# EAGLE design KW_Control (EAGLE 7.7.0)
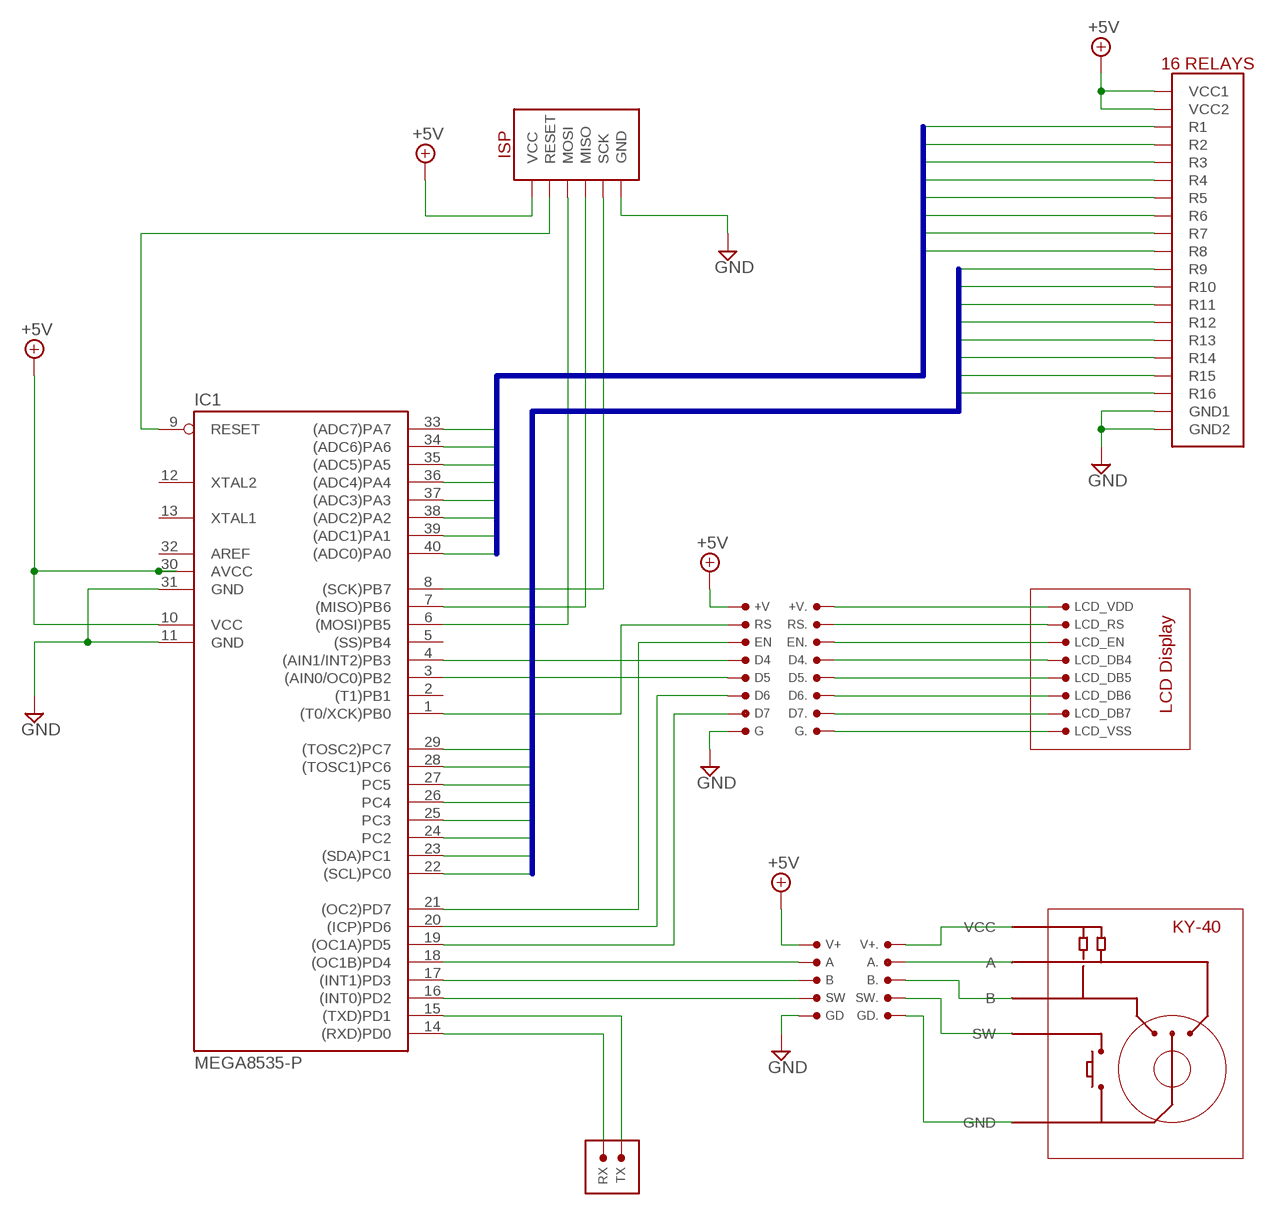
[diagram p0: schematic, sheet 1]

## Parts
+V  PIN  [PIN]
+V.  PIN  [PIN]
A  PIN  [PIN]
A.  PIN  [PIN]
B  PIN  [PIN]
B.  PIN  [PIN]
D4  PIN  [PIN]
D4.  PIN  [PIN]
D5  PIN  [PIN]
D5.  PIN  [PIN]
D6  PIN  [PIN]
D6.  PIN  [PIN]
D7  PIN  [PIN]
D7.  PIN  [PIN]
EN  PIN  [PIN]
EN.  PIN  [PIN]
G  PIN  [PIN]
G.  PIN  [PIN]
GD  PIN  [PIN]
GD.  PIN  [PIN]
IC1  MEGA8535-P  [DIL40]
IC2  KY-40  [KY-40]
LCD_DB4  PIN  [PIN]
LCD_DB5  PIN  [PIN]
LCD_DB6  PIN  [PIN]
LCD_DB7  PIN  [PIN]
LCD_EN  PIN  [PIN]
LCD_RS  PIN  [PIN]
LCD_VDD  PIN  [PIN]
LCD_VSS  PIN  [PIN]
RS  PIN  [PIN]
RS.  PIN  [PIN]
RX  PIN  [PIN]
SW  PIN  [PIN]
SW.  PIN  [PIN]
TX  PIN  [PIN]
U$1  ISP  [ISP]
U$2  RELAYS-16  [RELAYS-16]
V+  PIN  [PIN]
V+.  PIN  [PIN]

## Nets
+5V: +V.P$1(PIN1) IC1.10(VCC) IC1.30(AVCC) U$1.VCC U$2.VCC1 U$2.VCC2 V+.P$1(PIN1)
A1: IC1.40((ADC0)PA0) U$2.1(R1)
A2: IC1.39((ADC1)PA1) U$2.2(R2)
A3: IC1.38((ADC2)PA2) U$2.3(R3)
A4: IC1.37((ADC3)PA3) U$2.4(R4)
A5: IC1.36((ADC4)PA4) U$2.5(R5)
A6: IC1.35((ADC5)PA5) U$2.6(R6)
A7: IC1.34((ADC6)PA6) U$2.7(R7)
A8: IC1.33((ADC7)PA7) U$2.8(R8)
B1: IC1.22((SCL)PC0) U$2.9(R9)
B2: IC1.23((SDA)PC1) U$2.10(R10)
B3: IC1.24(PC2) U$2.11(R11)
B4: IC1.25(PC3) U$2.12(R12)
B5: IC1.26(PC4) U$2.13(R13)
B6: IC1.27(PC5) U$2.14(R14)
B7: IC1.28((TOSC1)PC6) U$2.15(R15)
B8: IC1.29((TOSC2)PC7) U$2.16(R16)
GND: G.P$1(PIN1) GD.P$1(PIN1) IC1.11(GND) IC1.31(GND) U$1.GND U$2.GND1 U$2.GND2
MISO: IC1.7((MISO)PB6) U$1.MISO
MOSI: IC1.6((MOSI)PB5) U$1.MOSI
N$1: D7.P$1(PIN1) IC1.19((OC1A)PD5)
N$2: D6.P$1(PIN1) IC1.20((ICP)PD6)
N$3: D5.P$1(PIN1) IC1.3((AIN0/OC0)PB2)
N$4: D4.P$1(PIN1) IC1.4((AIN1/INT2)PB3)
N$5: +V..P$1(PIN1) LCD_VDD.P$1(PIN1)
N$6: G..P$1(PIN1) LCD_VSS.P$1(PIN1)
N$7: D4..P$1(PIN1) LCD_DB4.P$1(PIN1)
N$8: D7..P$1(PIN1) LCD_DB7.P$1(PIN1)
N$9: A.P$1(PIN1) IC1.18((OC1B)PD4)
N$10: B.P$1(PIN1) IC1.17((INT1)PD3)
N$11: IC1.16((INT0)PD2) SW.P$1(PIN1)
N$12: A..P$1(PIN1) IC2.A
N$13: B..P$1(PIN1) IC2.B
N$14: IC2.SW SW..P$1(PIN1)
N$15: IC2.VCC V+..P$1(PIN1)
N$16: GD..P$1(PIN1) IC2.GND
N$17: D6..P$1(PIN1) LCD_DB6.P$1(PIN1)
N$18: EN..P$1(PIN1) LCD_EN.P$1(PIN1)
N$19: LCD_RS.P$1(PIN1) RS..P$1(PIN1)
N$20: D5..P$1(PIN1) LCD_DB5.P$1(PIN1)
N$21: EN.P$1(PIN1) IC1.21((OC2)PD7)
N$23: IC1.1((T0/XCK)PB0) RS.P$1(PIN1)
RESET: IC1.9(RESET) U$1.RESET
RX: IC1.14((RXD)PD0) RX.P$1(PIN1)
SCK: IC1.8((SCK)PB7) U$1.SCK
TX: IC1.15((TXD)PD1) TX.P$1(PIN1)
Unconnected: IC1.2((T1)PB1) IC1.5((SS)PB4) IC1.12(XTAL2) IC1.13(XTAL1) IC1.32(AREF)

## Buses
A[1..8]
B[1..8]

## Notes on the sheet
- LCD Display

## Library data of the parts
+V +V. A A. B B. D4 D4. D5 D5. D6 D6. D7 D7. EN EN. G G. GD GD. LCD_DB4-LCD_DB7 LCD_EN LCD_RS LCD_VDD LCD_VSS RS RS. RX SW SW. TX V+ V+. = Connectors:PIN: SINGLE PIN
IC1 = atmel:MEGA8535-P: MICROCONTROLLER 8 Kbytes FLASH 512 bytes SRAM 512 bytes EEPROM USART 8-channel 10 bit ADC Source: avr.lbr; MPN: ATMEGA8535-16PU; OC_FARNELL: 9171444; OC_NEWARK: 01M6909
IC2 = Boutons:KY-40: KY-40 ROTATRY ENCODER WITH SWITCH
U$1 = Connectors:ISP: ISP AVR ISP 6 pins Connector
U$2 = Connectors:RELAYS-16: ISP AVR ISP 6 pins Connector

## Board
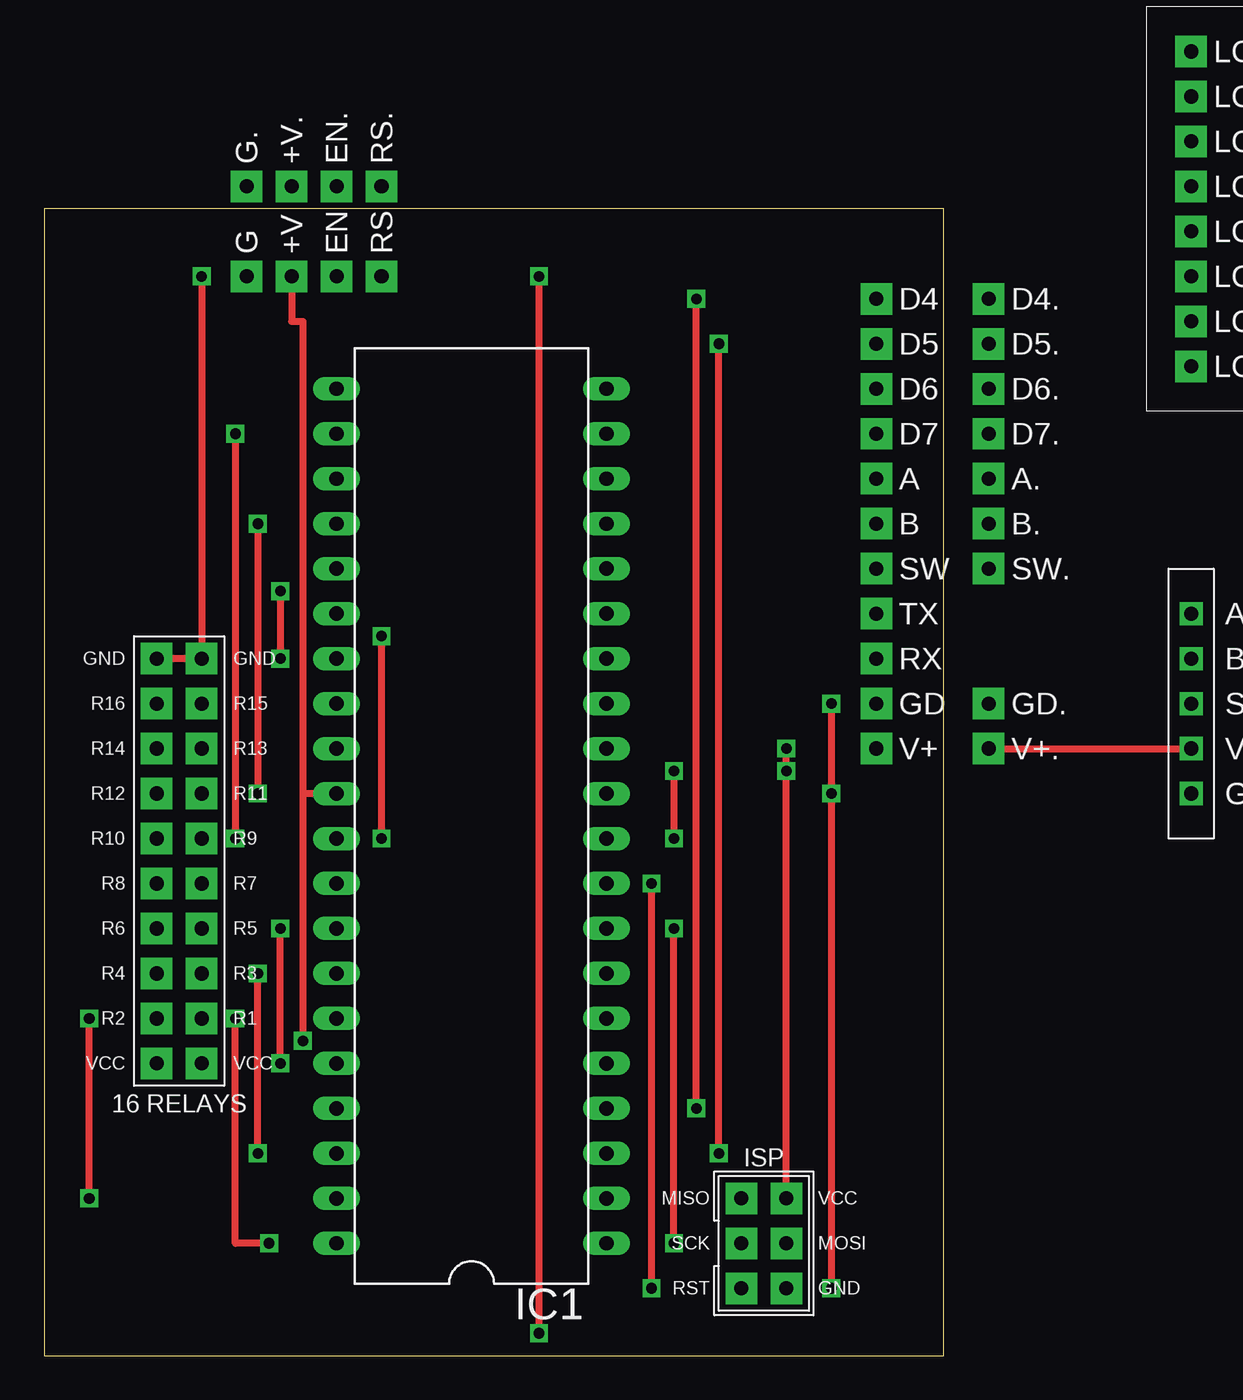
[diagram p1: board, top side]
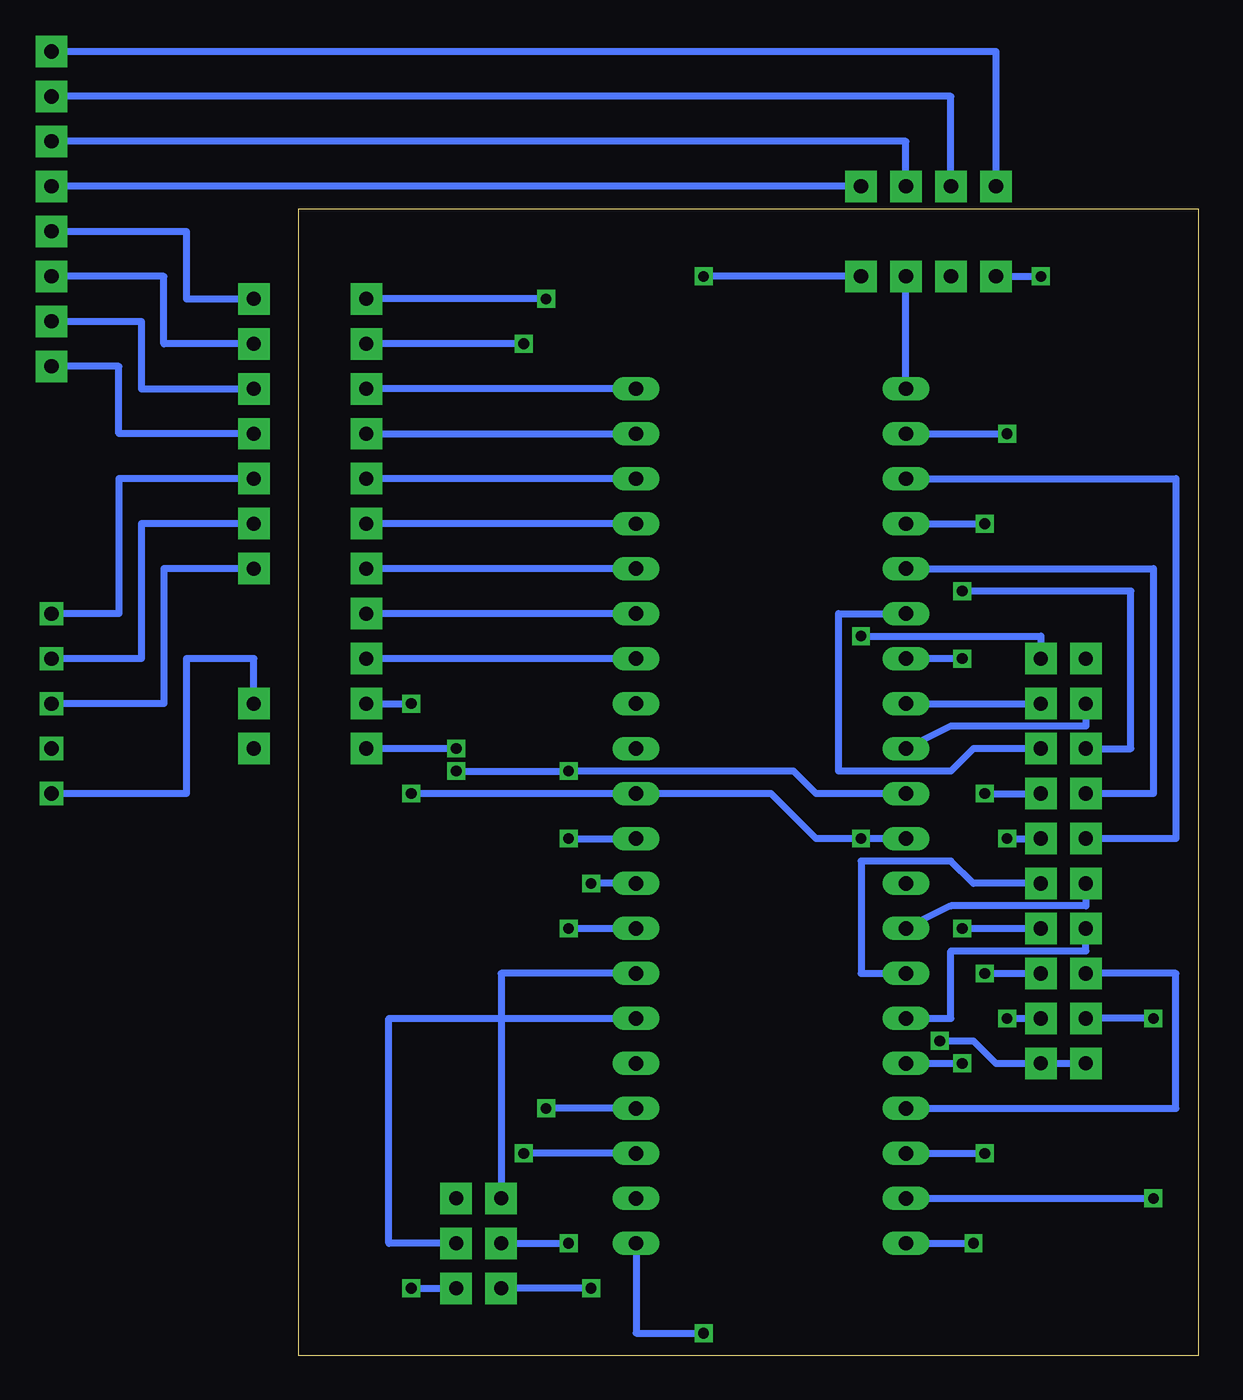
[diagram p2: board, bottom side, seen from below]

Size 50.8 x 64.77 mm. Coordinates in mm from the lower left corner, seen from the top.
Outline: 50.8,64.77 0,64.77 0,0 50.8,0 50.8,64.77
Copper layers (1*16): Top 0.035mm / dielectric 1.5mm / Bottom 0.035mm
Design rules "default": minimum track width 10mil, minimum drill 24mil, track to track 8mil, track to pad 8mil, pad to pad 8mil, via to via 8mil, smd to smd 8mil, copper to edge 40mil, drill to drill 8mil, minimum pad ring 10mil, minimum via ring 8mil, stop-mask expansion 4mil, vias tented up to drill 0mil, thermal gap 10mil

### Footprints (pad centres in the part's own frame; a part is rotated, then mirrored left to right if it is on the bottom)
PIN = drill 0.8 pad 1.778 square: P$1 0,0
DIL40 = drill 0.813 long: 1 -24.13,-7.62; 2 -21.59,-7.62; 3 -19.05,-7.62; 4 -16.51,-7.62; 5 -13.97,-7.62; 6 -11.43,-7.62; 7 -8.89,-7.62; 8 -6.35,-7.62; 9 -3.81,-7.62; 10 -1.27,-7.62; 11 1.27,-7.62; 12 3.81,-7.62; 13 6.35,-7.62; 14 8.89,-7.62; 15 11.43,-7.62; 16 13.97,-7.62; 17 16.51,-7.62; 18 19.05,-7.62; 19 21.59,-7.62; 20 24.13,-7.62; 21 24.13,7.62; 22 21.59,7.62; 23 19.05,7.62; 24 16.51,7.62; 25 13.97,7.62; 26 11.43,7.62; 27 8.89,7.62; 28 6.35,7.62; 29 3.81,7.62; 30 1.27,7.62; 31 -1.27,7.62; 32 -3.81,7.62; 33 -6.35,7.62; 34 -8.89,7.62; 35 -11.43,7.62; 36 -13.97,7.62; 37 -16.51,7.62; 38 -19.05,7.62; 39 -21.59,7.62; 40 -24.13,7.62
KY-40 = drill 0.8 square: A -5.08,0; B -2.54,0; GND 5.08,0; SW 0,0; VCC 2.54,0
ISP = drill 0.8 pad 1.778 square: GND 2.54,-5.08; MISO 0,0; MOSI 2.54,-2.54; RESET 0,-5.08; SCK 0,-2.54; VCC 2.54,0
RELAYS-16 = drill 0.8 pad 1.778 square: 1 0,-2.54; 2 2.54,-2.54; 3 0,-5.08; 4 2.54,-5.08; 5 0,-7.62; 6 2.54,-7.62; 7 0,-10.16; 8 2.54,-10.16; 9 0,-12.7; 10 2.54,-12.7; 11 0,-15.24; 12 2.54,-15.24; 13 0,-17.78; 14 2.54,-17.78; 15 0,-20.32; 16 2.54,-20.32; GND1 0,-22.86; GND2 2.54,-22.86; VCC1 0,0; VCC2 2.54,0

### Placement (x,y rotation side)
+V  13.97,60.96 90 top
+V.  13.97,66.04 90 top
A  46.99,49.53 0 top
A.  53.34,49.53 0 top
B  46.99,46.99 0 top
B.  53.34,46.99 0 top
D4  46.99,59.69 0 top
D4.  53.34,59.69 0 top
D5  46.99,57.15 0 top
D5.  53.34,57.15 0 top
D6  46.99,54.61 0 top
D6.  53.34,54.61 0 top
D7  46.99,52.07 0 top
D7.  53.34,52.07 0 top
EN  16.51,60.96 90 top
EN.  16.51,66.04 90 top
G  11.43,60.96 90 top
G.  11.43,66.04 90 top
GD  46.99,36.83 0 top
GD.  53.34,36.83 0 top
IC1  24.13,30.48 90 top
IC2  64.77,36.83 270 top  (outside the outline)
LCD_DB4  64.77,63.5 0 top  (outside the outline)
LCD_DB5  64.77,60.96 0 top  (outside the outline)
LCD_DB6  64.77,58.42 0 top  (outside the outline)
LCD_DB7  64.77,55.88 0 top  (outside the outline)
LCD_EN  64.77,68.58 0 top  (outside the outline)
LCD_RS  64.77,66.04 0 top  (outside the outline)
LCD_VDD  64.77,71.12 0 top  (outside the outline)
LCD_VSS  64.77,73.66 0 top  (outside the outline)
RS  19.05,60.96 90 top
RS.  19.05,66.04 90 top
RX  46.99,39.37 0 top
SW  46.99,44.45 0 top
SW.  53.34,44.45 0 top
TX  46.99,41.91 0 top
U$1  39.37,8.89 0 top
U$2  8.89,16.51 180 top
V+  46.99,34.29 0 top
V+.  53.34,34.29 0 top

### Tracks (layer width: path | path; a pad name or v marks a point on that pad's centre or on a via)
+5V  (via drill 0.6)
  Top 0.406: U$1.VCC v41.91,33.02 v41.91,34.29 | IC1.30 14.61,31.75 | 14.61,31.75 v14.61,17.78 | v35.56,33.02 v35.56,29.21 | +V.P$1 13.97,58.42 14.61,58.42 14.61,31.75
  Bottom 0.406: v14.61,17.78 12.7,17.78 11.43,16.51 U$2.VCC1 U$2.VCC2 | v41.91,33.02 v35.56,33.02 22.86,33.02 21.59,31.75 IC1.30 | v35.56,29.21 IC1.10 | v41.91,34.29 V+.P$1
A1  (via drill 0.6)
  Top 0.406: v12.7,6.35 10.79,6.35 v10.79,19.05
  Bottom 0.406: IC1.40 v12.7,6.35 | v10.79,19.05 U$2.1
A2  (via drill 0.6)
  Top 0.406: v2.54,8.89 v2.54,19.05
  Bottom 0.406: IC1.39 v2.54,8.89 | v2.54,19.05 U$2.2
A3  (via drill 0.6)
  Top 0.406: v12.06,11.43 v12.06,21.59
  Bottom 0.406: IC1.38 v12.06,11.43 | v12.06,21.59 U$2.3
A4
  Bottom 0.406: IC1.37 1.27,13.97 1.27,21.59 U$2.4
A5  (via drill 0.6)
  Top 0.406: v13.34,16.51 v13.34,24.13
  Bottom 0.406: IC1.36 v13.34,16.51 | v13.34,24.13 U$2.5
A6
  Bottom 0.406: IC1.35 13.97,19.05 13.97,22.86 6.35,22.86 U$2.6
A7
  Bottom 0.406: U$2.7 12.7,26.67 13.97,27.94 19.05,27.94 19.05,21.59 IC1.34
A8
  Bottom 0.406: U$2.8 6.35,25.4 13.97,25.4 IC1.33
B1  (via drill 0.6)
  Top 0.406: v10.79,52.07 v10.79,29.21
  Bottom 0.406: IC1.22 v10.79,52.07 | v10.79,29.21 U$2.9
B2
  Bottom 0.406: IC1.23 1.27,49.53 1.27,29.21 U$2.10
B3  (via drill 0.6)
  Top 0.406: v12.06,46.99 v12.06,31.75
  Bottom 0.406: IC1.24 v12.06,46.99 | v12.06,31.75 U$2.11
B4
  Bottom 0.406: IC1.25 2.54,44.45 2.54,31.75 U$2.12
B5
  Bottom 0.406: U$2.13 12.7,34.29 13.97,33.02 20.32,33.02 20.32,41.91 IC1.26
B6  (via drill 0.6)
  Top 0.406: v13.34,43.18 v13.34,39.37
  Bottom 0.406: U$2.14 3.81,34.29 3.81,43.18 v13.34,43.18 | v13.34,39.37 IC1.27
B7
  Bottom 0.406: IC1.28 U$2.15
B8
  Bottom 0.406: U$2.16 6.35,35.56 13.97,35.56 IC1.29
GND  (via drill 0.6)
  Top 0.406: v19.05,29.21 v19.05,40.64 | U$2.GND2 U$2.GND1 v8.89,60.96 | v44.45,36.83 v44.45,31.75 v44.45,3.81
  Bottom 0.406: v44.45,31.75 IC1.11 24.13,31.75 21.59,29.21 IC1.31 v19.05,29.21 | v19.05,40.64 8.89,40.64 U$2.GND1 | GD.P$1 v44.45,36.83 | v44.45,3.81 U$1.GND | G.P$1 v8.89,60.96
MISO
  Bottom 0.406: IC1.7 39.37,21.59 U$1.MISO
MOSI
  Bottom 0.406: U$1.MOSI 45.72,6.35 45.72,19.05 IC1.6
N$1
  Bottom 0.406: D7.P$1 IC1.19
N$2
  Bottom 0.406: IC1.20 D6.P$1
N$3  (via drill 0.6)
  Top 0.406: v38.1,11.43 v38.1,57.15
  Bottom 0.406: IC1.3 v38.1,11.43 | v38.1,57.15 D5.P$1
N$4  (via drill 0.6)
  Top 0.406: v36.83,13.97 v36.83,59.69
  Bottom 0.406: IC1.4 v36.83,13.97 | v36.83,59.69 D4.P$1
N$5
  Bottom 0.406: +V..P$1 13.97,71.12 LCD_VDD.P$1
N$6
  Bottom 0.406: LCD_VSS.P$1 11.43,73.66 G..P$1
N$7
  Bottom 0.406: LCD_DB4.P$1 57.15,63.5 57.15,59.69 D4..P$1
N$8
  Bottom 0.406: D7..P$1 60.96,52.07 60.96,55.88 LCD_DB7.P$1
N$9
  Bottom 0.406: IC1.18 A.P$1
N$10
  Bottom 0.406: IC1.17 B.P$1
N$11
  Bottom 0.406: IC1.16 SW.P$1
N$12
  Bottom 0.406: A..P$1 60.96,49.53 60.96,41.91 IC2.A
N$13
  Bottom 0.406: B..P$1 59.69,46.99 59.69,39.37 IC2.B
N$14
  Bottom 0.406: SW..P$1 58.42,44.45 58.42,36.83 IC2.SW
N$15
  Top 0.406: V+..P$1 IC2.VCC
N$16
  Bottom 0.406: GD..P$1 53.34,39.37 57.15,39.37 57.15,31.75 IC2.GND
N$17
  Bottom 0.406: LCD_DB6.P$1 59.69,58.42 59.69,54.61 D6..P$1
N$18
  Bottom 0.406: EN..P$1 16.51,68.58 LCD_EN.P$1
N$19
  Bottom 0.406: RS..P$1 LCD_RS.P$1
N$20
  Bottom 0.406: D5..P$1 58.42,57.15 58.42,60.96 LCD_DB5.P$1
N$21
  Bottom 0.406: IC1.21 EN.P$1
N$23  (via drill 0.6)
  Top 0.406: v27.94,60.96 v27.94,1.27
  Bottom 0.406: IC1.1 31.75,1.27 v27.94,1.27 | RS.P$1 v27.94,60.96
RESET  (via drill 0.6)
  Top 0.406: v34.29,26.67 v34.29,3.81
  Bottom 0.406: IC1.9 v34.29,26.67 | v34.29,3.81 U$1.RESET
RX
  Bottom 0.406: IC1.14 RX.P$1
SCK  (via drill 0.6)
  Top 0.406: v35.56,6.35 v35.56,24.13
  Bottom 0.406: U$1.SCK v35.56,6.35 | v35.56,24.13 IC1.8
TX
  Bottom 0.406: IC1.15 TX.P$1